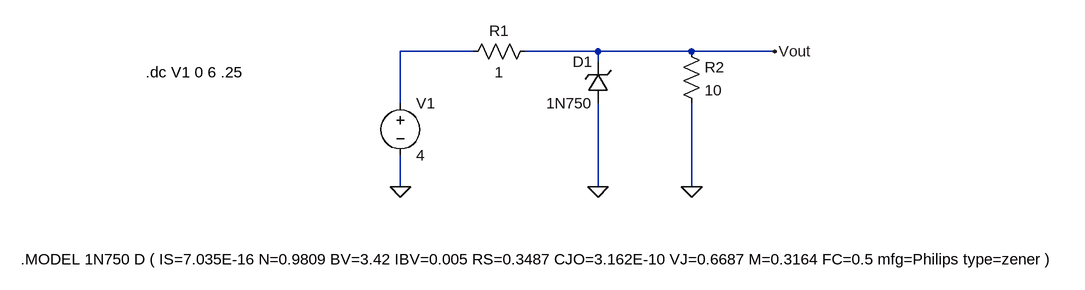
[diagram p0: schematic psu overvoltage protection.asc]
psu overvoltage protection.asc, the LTspice schematic file:
Version 4
SHEET 1 1756 680
WIRE 720 -80 608 -80
WIRE 912 -80 800 -80
WIRE 1056 -80 912 -80
WIRE 1184 -80 1056 -80
WIRE 912 -64 912 -80
WIRE 608 0 608 -80
WIRE 608 128 608 80
WIRE 912 128 912 0
WIRE 1056 128 1056 0
FLAG 608 128 0
FLAG 912 128 0
FLAG 1056 128 0
FLAG 1184 -80 Vout
SYMBOL voltage 608 -16 R0
WINDOW 123 0 0 Left 0
SYMATTR InstName V1
SYMATTR Value 4
SYMATTR SpiceLine Rser=.001
SYMBOL zener 928 0 R180
WINDOW 0 24 64 Left 2
WINDOW 3 24 0 Left 2
SYMATTR InstName D1
SYMATTR Value 1N750
SYMBOL res 1040 -96 R0
SYMATTR InstName R2
SYMATTR Value 10
SYMBOL res 816 -96 R90
WINDOW 0 0 56 VBottom 2
WINDOW 3 32 56 VTop 2
SYMATTR InstName R1
SYMATTR Value 1
TEXT 24 240 Left 2 !.MODEL 1N750 D ( IS=7.035E-16 N=0.9809 BV=3.42 IBV=0.005 RS=0.3487 CJO=3.162E-10 VJ=0.6687 M=0.3164 FC=0.5 mfg=Philips type=zener )
TEXT 216 -48 Left 2 !.dc V1 0 6 .25

The netlist it stands for:
* psu overvoltage protection.asc
V1 N001 0 4 Rser=.001
D1 0 Vout 1N750
R2 Vout 0 10
R1 Vout N001 1
.model D D
.lib standard.dio
.MODEL 1N750 D ( IS=7.035E-16 N=0.9809 BV=3.42 IBV=0.005 RS=0.3487 CJO=3.162E-10 VJ=0.6687 M=0.3164 FC=0.5 mfg=Philips type=zener )
.dc V1 0 6 .25
.backanno
.end